# EasyEDA Pro project 快慢上电自动化.eprj

# Schematic Schematic1

## Sheets
1 P1
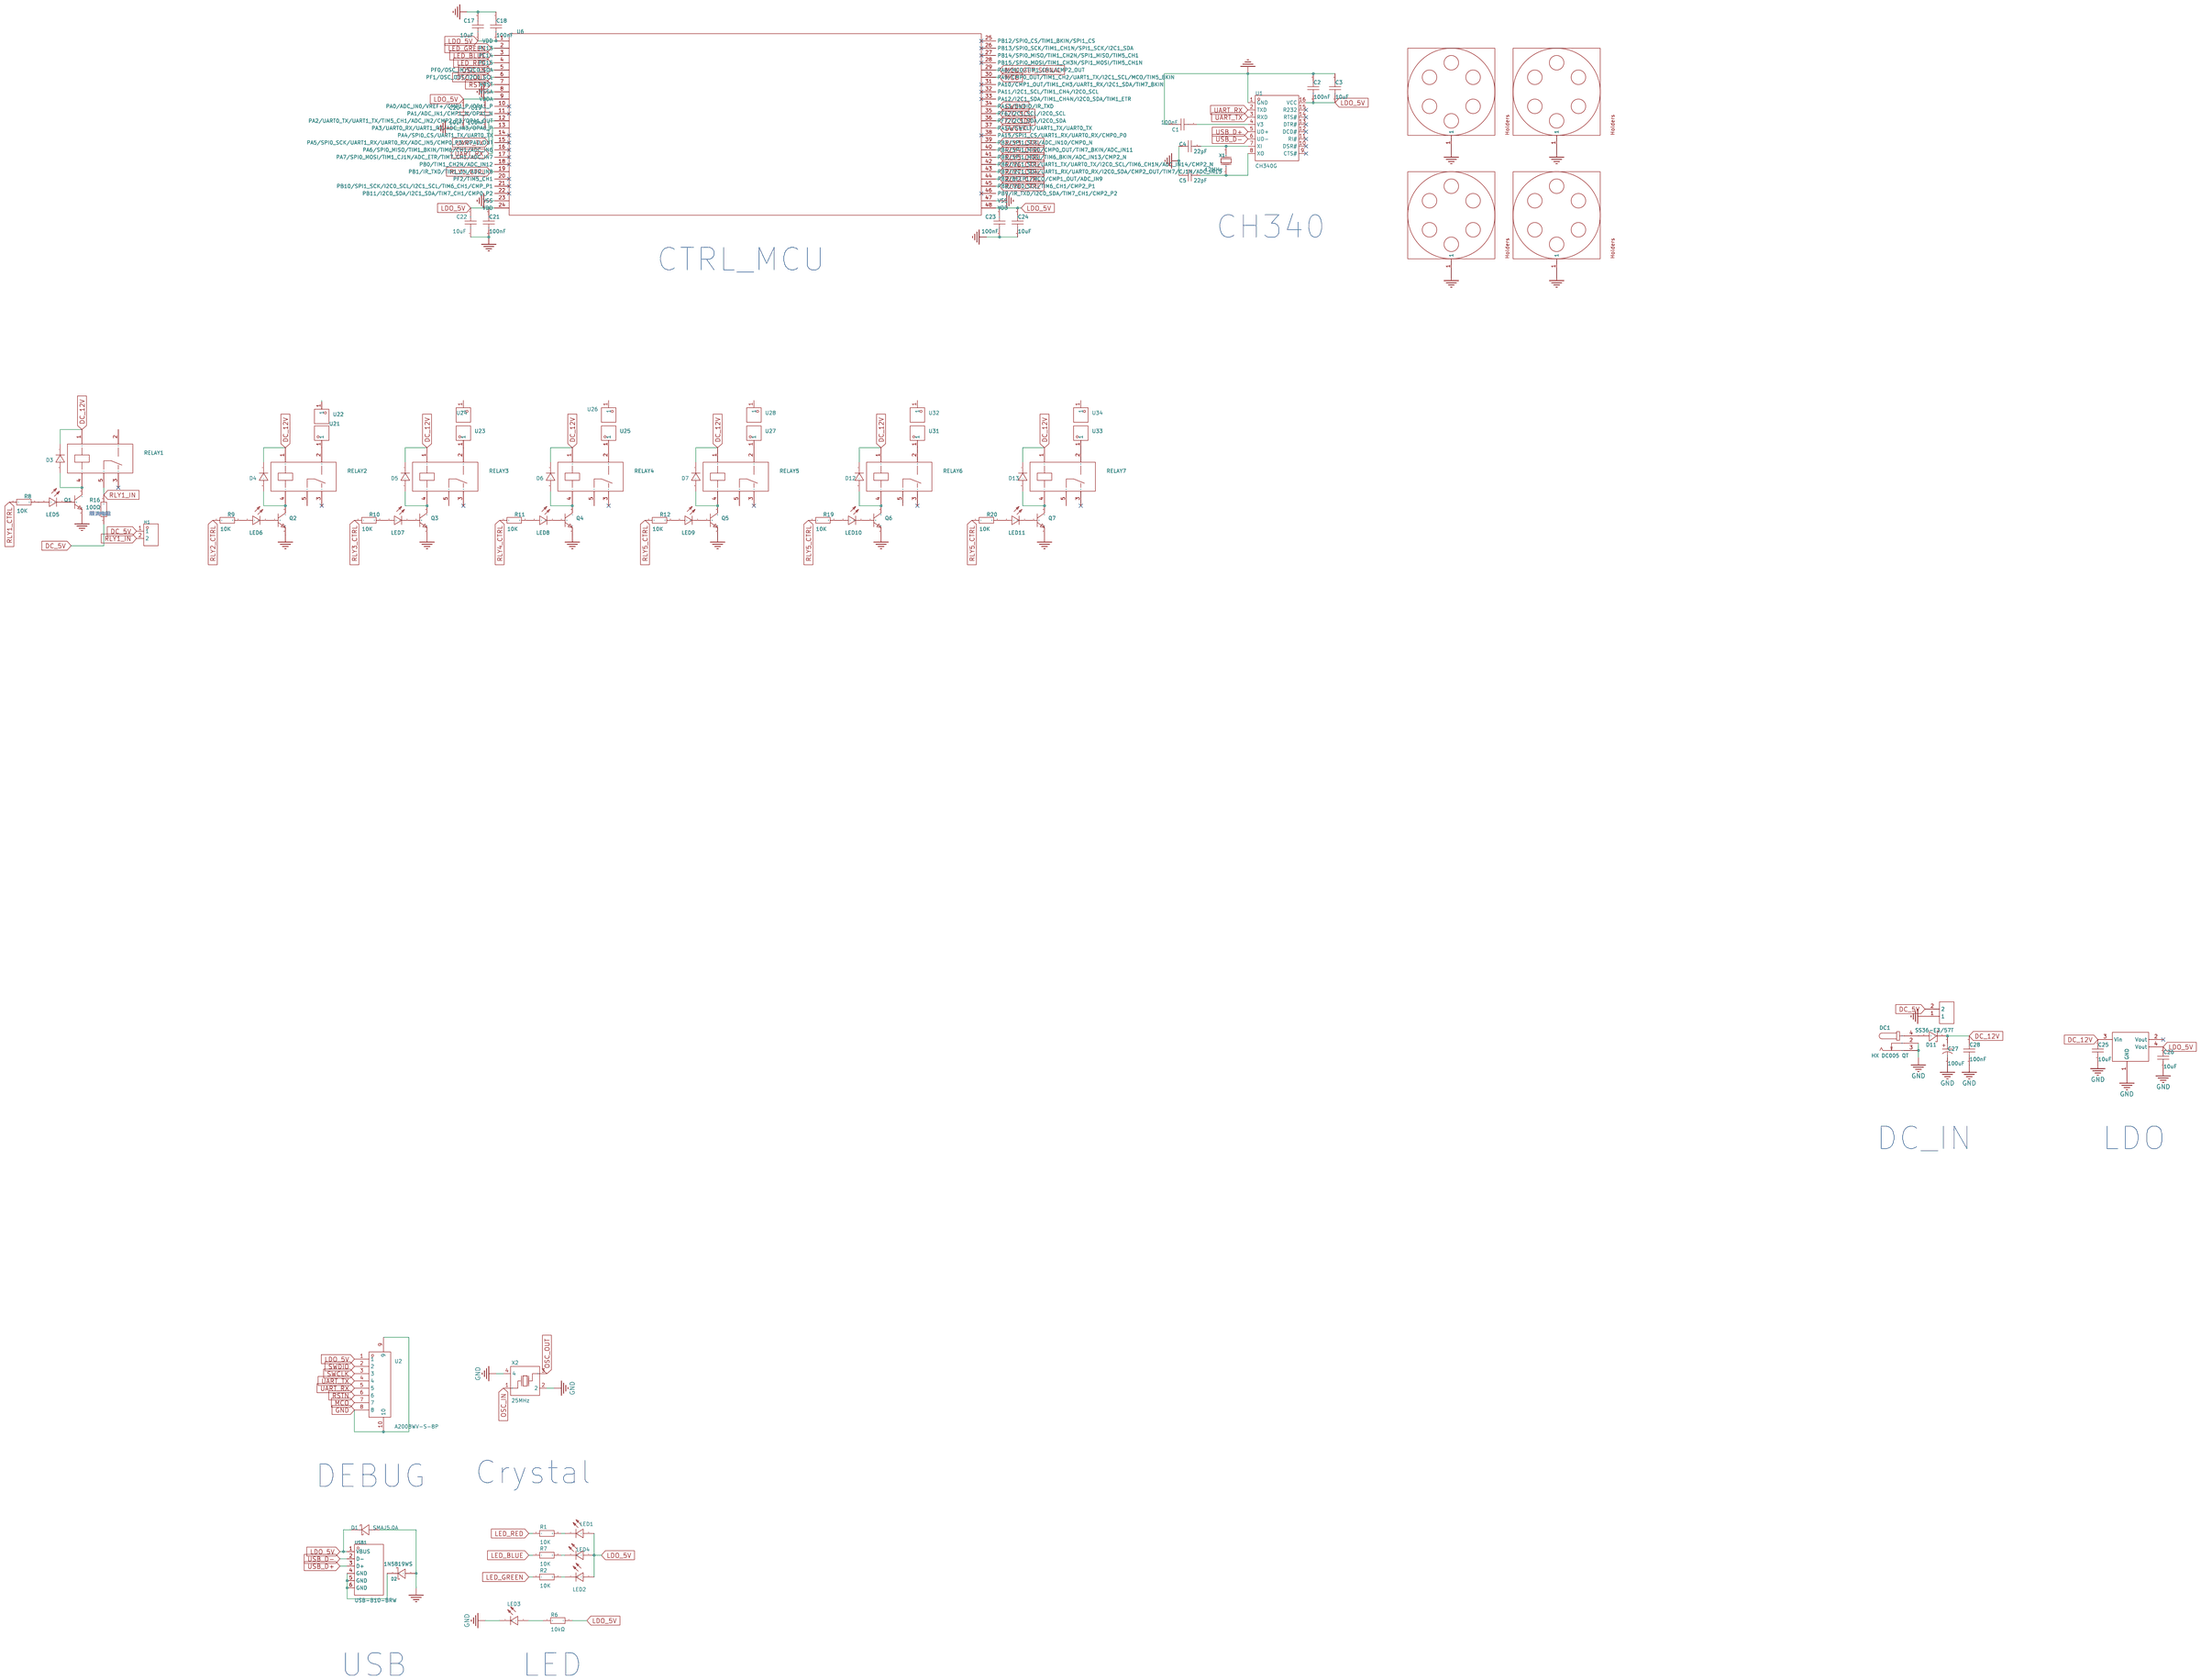
[diagram p0: P1]
2 P3: Create Date: 2023-10-24; Page Name: P3; Project Name: 快慢上电自动化; Schematic Name: Schematic1; Update Date: 2023-10-24; Company: 嘉立创EDA; Page Size: A4; Version: V1.0
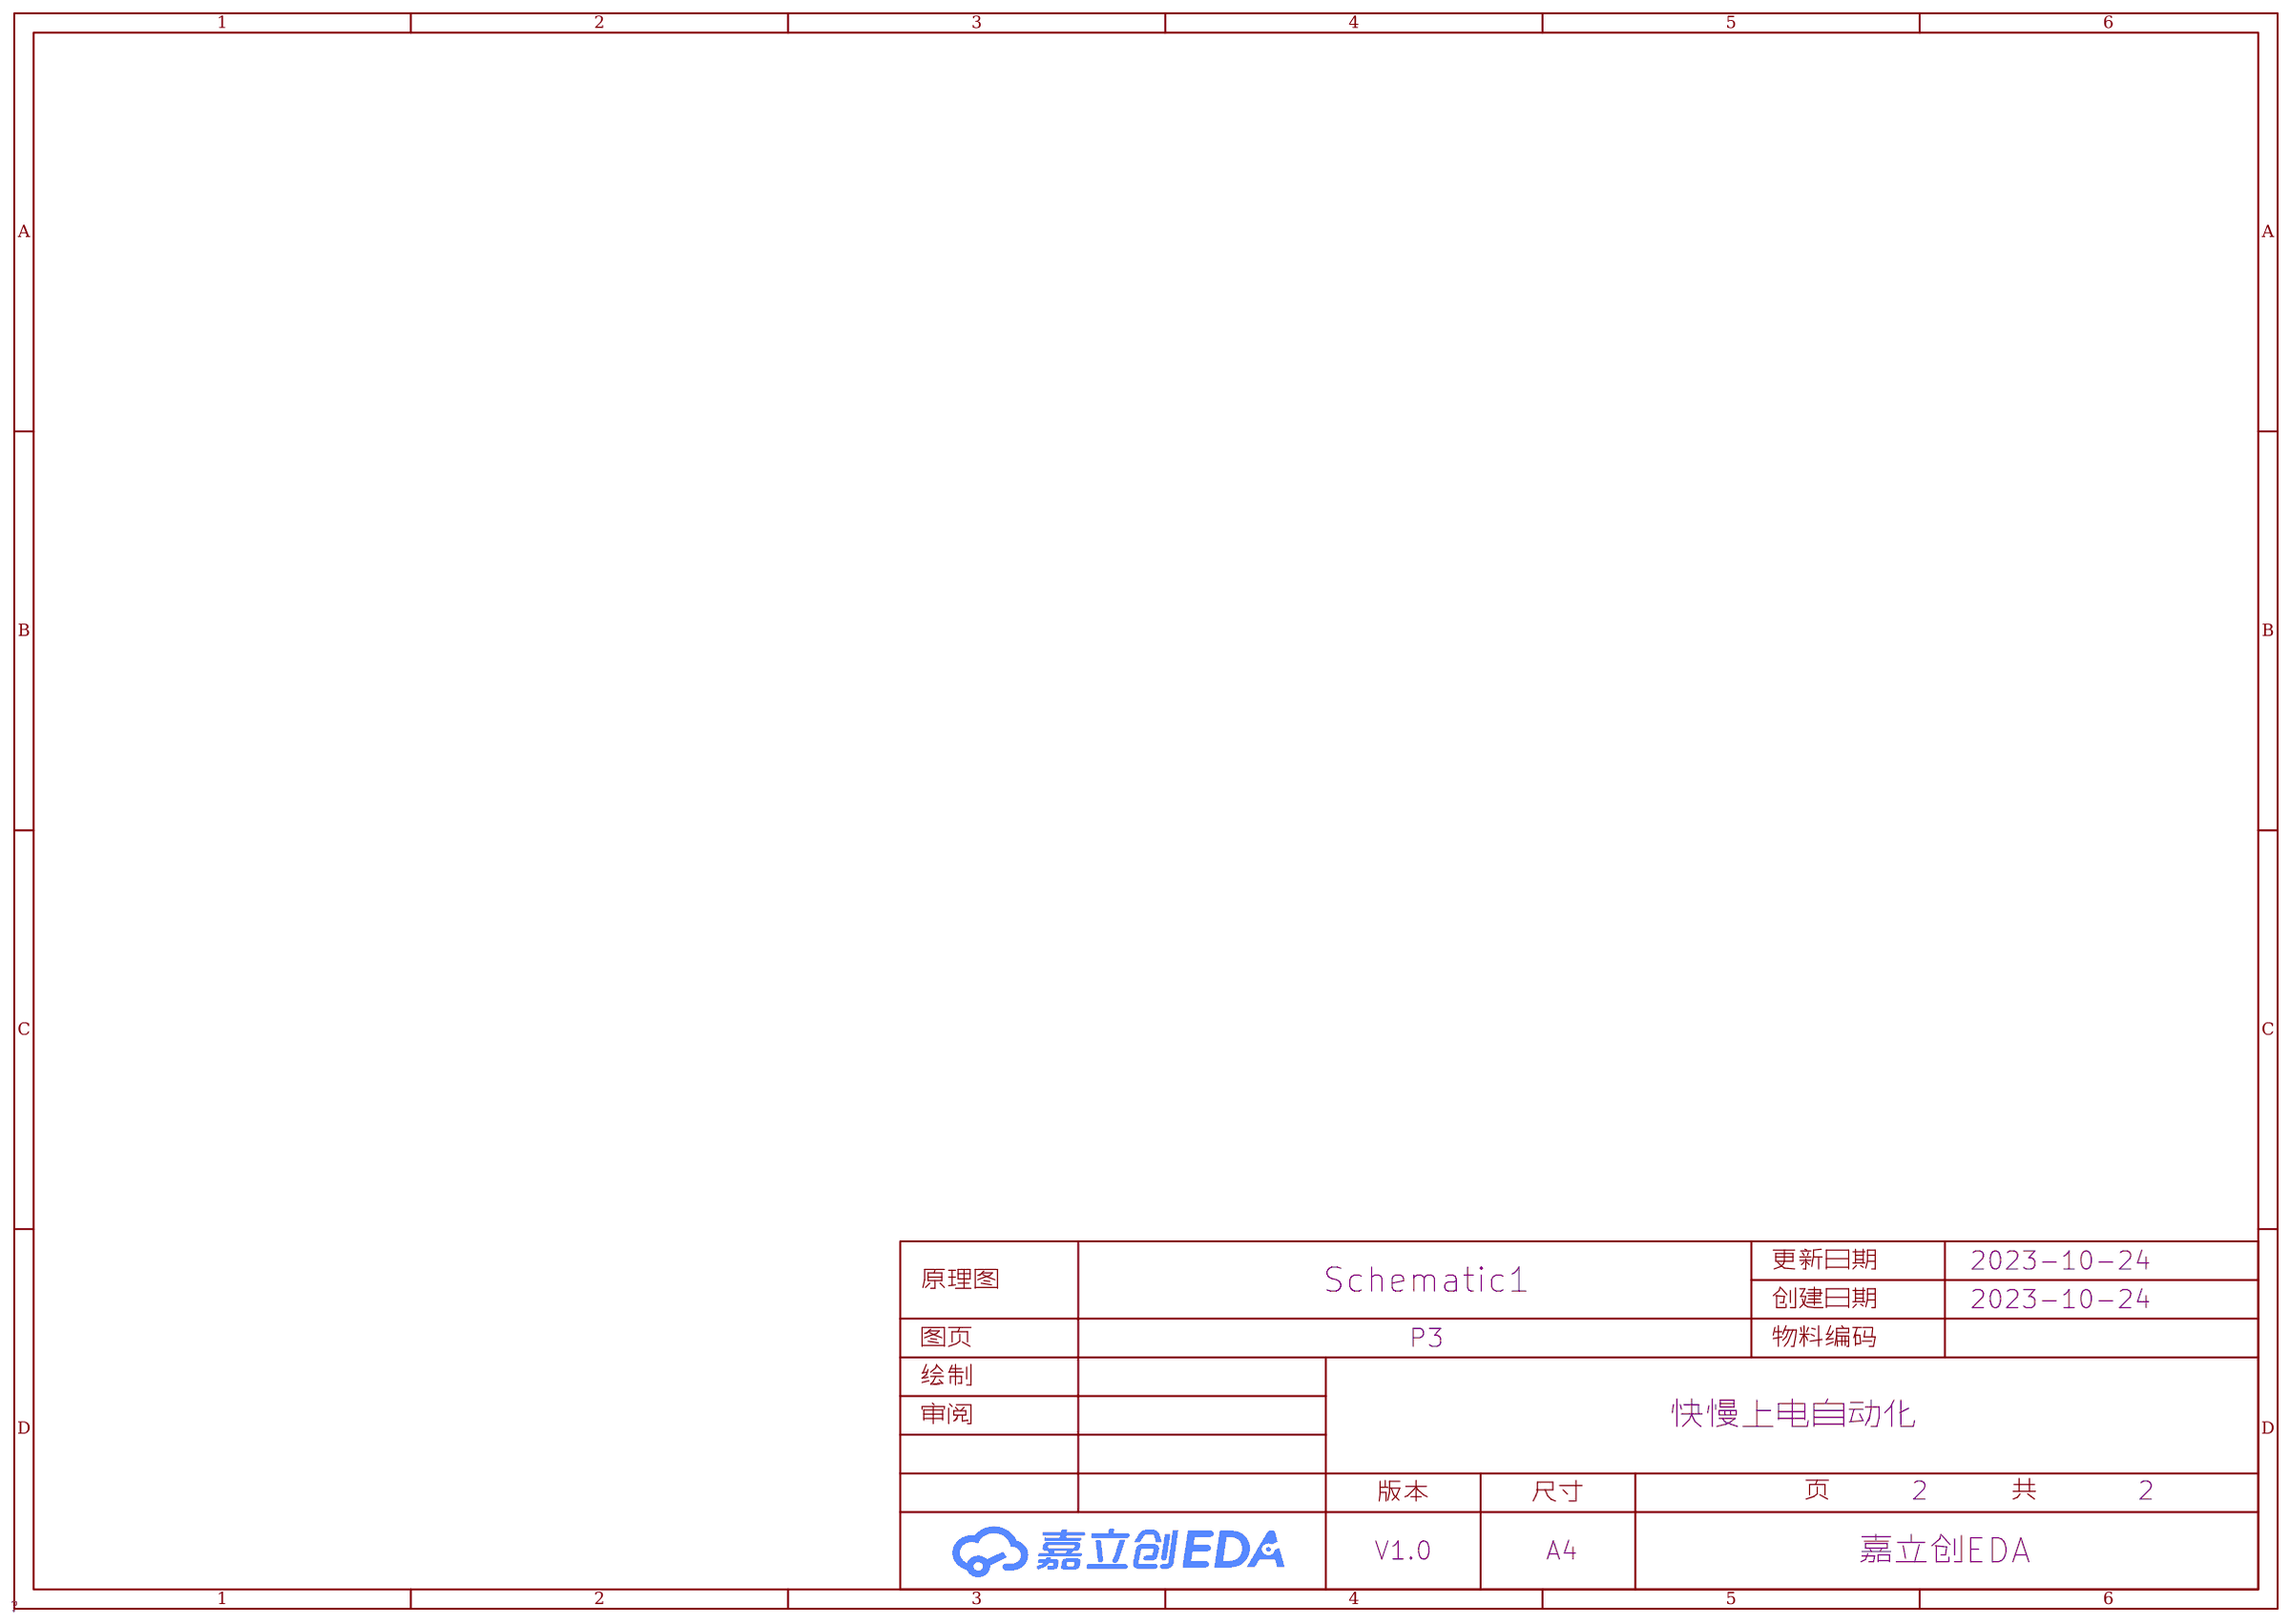
[diagram p1: P3]

## Parts
C1  100nF  [C0603]
C2  100nF  [C0603]
C3  10uF  [C0603]
C4  22pF  [C0603]
C5  22pF  [C0603]
C17  10uF  [C0603]
C18  100nF  [C0603]
C19  100nF  [C0603]
C20  10uF  [C0603]
C21  100nF  [C0603]
C22  10uF  [C0603]
C23  100nF  [C0603]
C24  10uF  [C0603]
C25  10uF  [C1206]
C26  10uF  [C1206]
C27  100uF  [CAP-SMD_BD6.3-L6.6-W6.6-LS7.6-FD-1]
C28  100nF  [C0603]
D1  SMAJ5.0A  [SMA_L4.3-W2.6-LS5.0-RD]
D2  1N5819WS  [SOD-323_L1.8-W1.3-LS2.5-RD]
D3  1N4148WS  [SOD-323_L1.8-W1.3-LS2.5-RD]
D4  1N4148WS  [SOD-323_L1.8-W1.3-LS2.5-RD]
D5  1N4148WS  [SOD-323_L1.8-W1.3-LS2.5-RD]
D6  1N4148WS  [SOD-323_L1.8-W1.3-LS2.5-RD]
D7  1N4148WS  [SOD-323_L1.8-W1.3-LS2.5-RD]
D11  SS36-E3/57T  [SMC_L7.1-W6.2-LS8.1-R-RD]
D12  1N4148WS  [SOD-323_L1.8-W1.3-LS2.5-RD]
D13  1N4148WS  [SOD-323_L1.8-W1.3-LS2.5-RD]
DC1  HX DC005 QT  [DC-IN-TH_HANXIA_HX-DC005-QT]
H1  PZ254V-11-02P  [HDR-TH_2P-P2.54-V-M]
J2  -  [DEMO板安装孔]
J3  -  [DEMO板安装孔]
J4  -  [DEMO板安装孔]
J5  -  [DEMO板安装孔]
LED1  NCD0603R1  [LED0603-RD_RED]
LED2  19-217/GHC-YR1S2/3T  [LED0603-RD]
LED3  19-217/GHC-YR1S2/3T  [LED0603-RD]
LED4  19-217/BHC-ZL1M2RY/3T  [LED0603-FD_BLUE]
LED5  19-217/GHC-YR1S2/3T  [LED0603-RD]
LED6  19-217/GHC-YR1S2/3T  [LED0603-RD]
LED7  19-217/GHC-YR1S2/3T  [LED0603-RD]
LED8  19-217/GHC-YR1S2/3T  [LED0603-RD]
LED9  19-217/GHC-YR1S2/3T  [LED0603-RD]
LED10  19-217/GHC-YR1S2/3T  [LED0603-RD]
LED11  19-217/GHC-YR1S2/3T  [LED0603-RD]
P1  WJ500V-5.08-2P  [CONN-TH_2P-P5.00_WJ500V-5.08-2P]
Q1  SS8050  [SOT-23-3_L2.9-W1.3-P1.90-LS2.4-BR]
Q2  SS8050  [SOT-23-3_L2.9-W1.3-P1.90-LS2.4-BR]
Q3  SS8050  [SOT-23-3_L2.9-W1.3-P1.90-LS2.4-BR]
Q4  SS8050  [SOT-23-3_L2.9-W1.3-P1.90-LS2.4-BR]
Q5  SS8050  [SOT-23-3_L2.9-W1.3-P1.90-LS2.4-BR]
Q6  SS8050  [SOT-23-3_L2.9-W1.3-P1.90-LS2.4-BR]
Q7  SS8050  [SOT-23-3_L2.9-W1.3-P1.90-LS2.4-BR]
R1  10K  [R0603]
R2  10K  [R0603]
R6  10kΩ  [R0603]
R7  10K  [R0603]
R8  10K  [R0603]
R9  10K  [R0603]
R10  10K  [R0603]
R11  10K  [R0603]
R12  10K  [R0603]
R16  100Ω  [R0805]
R19  10K  [R0603]
R20  10K  [R0603]
RELAY1  SRD-12VDC-SL-C  [RELAY-TH_SRD-XXVDC-XL-C]
RELAY2  SRD-12VDC-SL-C  [RELAY-TH_SRD-XXVDC-XL-C]
RELAY3  SRD-12VDC-SL-C  [RELAY-TH_SRD-XXVDC-XL-C]
RELAY4  SRD-12VDC-SL-C  [RELAY-TH_SRD-XXVDC-XL-C]
RELAY5  SRD-12VDC-SL-C  [RELAY-TH_SRD-XXVDC-XL-C]
RELAY6  SRD-12VDC-SL-C  [RELAY-TH_SRD-XXVDC-XL-C]
RELAY7  SRD-12VDC-SL-C  [RELAY-TH_SRD-XXVDC-XL-C]
U1  CH340G  [SOIC-16_L9.9-W3.9-P1.27-LS6.0-BL]
U2  A2008WV-S-8P  [CONN-SMD_A2008WV-S-8P]
U6  PT32A030C8T7  [LQFP-48_7.0X7.0X0.5P]
U21  X5511FV-01-C30D97-0970  [HDR-TH_1P-V-F-1]
U22  X5511FV-01-C30D97-0970  [HDR-TH_1P-V-F-1]
U23  X5511FV-01-C30D97-0970  [HDR-TH_1P-V-F-1]
U24  X5511FV-01-C30D97-0970  [HDR-TH_1P-V-F-1]
U25  X5511FV-01-C30D97-0970  [HDR-TH_1P-V-F-1]
U26  X5511FV-01-C30D97-0970  [HDR-TH_1P-V-F-1]
U27  X5511FV-01-C30D97-0970  [HDR-TH_1P-V-F-1]
U28  X5511FV-01-C30D97-0970  [HDR-TH_1P-V-F-1]
U30  AMS1086CM-5.0  [TO-263-3_L8.6-W10.2-P2.54-LS14.4-TL]
U31  X5511FV-01-C30D97-0970  [HDR-TH_1P-V-F-1]
U32  X5511FV-01-C30D97-0970  [HDR-TH_1P-V-F-1]
U33  X5511FV-01-C30D97-0970  [HDR-TH_1P-V-F-1]
U34  X5511FV-01-C30D97-0970  [HDR-TH_1P-V-F-1]
USB1  USB-B10-BRW  [USB-B-TH_USB-B10-BRW]
X1  12MHz  [HC-49US_L11.5-W4.5-P4.88]
X2  25MHz  [OSC-SMD_4P-L2.5-W2.0-BL]

## Library data of the parts
C1 C2 C18 C19 C21 C23 = CC0603KRX7R9BB104: 容值:100nF;精度:±10%;额定电压:50V;材质(温度系数):X7R;; LCSC Part Name: 100nF ±10% 50V; Supplier Part: C14663; Manufacturer: YAGEO(国巨); Supplier Footprint: 0603; JLCPCB Part Class: Basic Part; Datasheet: https://atta.szlcsc.com/upload/public/pdf/source/20180910/C282072_33301C7F631E79921B82A8DAC6BCC5B3.pdf; Supplier: LCSC; Tolerance: ±10%; Voltage Rated: 50V; Temperature Coefficient: X7R
C3 C17 C20 C22 C24 = CL10A106KP8NNNC: 容值:10uF;精度:±10%;额定电压:10V;材质(温度系数):X5R;; LCSC Part Name: 10uF ±10% 10V; Supplier Part: C19702; Manufacturer: SAMSUNG(三星); Supplier Footprint: 0603; JLCPCB Part Class: Basic Part; Datasheet: https://atta.szlcsc.com/upload/public/pdf/source/20160103/1457707703378.pdf; Supplier: LCSC; Tolerance: ±10%; Voltage Rated: 10V; Temperature Coefficient: X5R
C4 C5 = CL10C220JB8NNNC: 容值:22pF;精度:±5%;额定电压:50V;材质(温度系数):C0G;; LCSC Part Name: 22pF ±5% 50V; Supplier Part: C1653; Manufacturer: SAMSUNG(三星); Supplier Footprint: 0603; JLCPCB Part Class: Basic Part; Datasheet: https://atta.szlcsc.com/upload/public/pdf/source/20160103/1457707687317.pdf; Supplier: LCSC; Tolerance: ±5%; Voltage Rated: 50V; Temperature Coefficient: C0G
C25 C26 = CL31A106KBHNNNE: 容值:10uF;精度:±10%;额定电压:50V;材质(温度系数):X5R;; LCSC Part Name: 10uF ±10% 50V; Supplier Part: C13585; Manufacturer: SAMSUNG(三星); Supplier Footprint: 1206; JLCPCB Part Class: Basic Part; Datasheet: https://atta.szlcsc.com/upload/public/pdf/source/20160103/1457707668742.pdf; Supplier: LCSC; Tolerance: ±10%; Voltage Rated: 50V; Temperature Coefficient: X5R
C27 = RVE100UF35V67RV0072: 容值:100uF;额定电压:35V;电容体直径:-;电容体长度:-;纹波电流:-;等效串联电阻:-;工作寿命:-;; LCSC Part Name: 100uF 35V; Supplier Part: C2836437; Manufacturer: KNSCHA(科尼盛); Supplier Footprint: SMD,6.3x7.7mm; JLCPCB Part Class: Extended Part; Datasheet: https://atta.szlcsc.com/upload/public/pdf/source/20220719/B52EB46F8A1558448ED03D8B4CB3C24F.pdf; Supplier: LCSC; Rated Voltage: 35V
C28 = CL10B104KB8NNNC: 容值:100nF;精度:±10%;额定电压:50V;材质(温度系数):X7R;; LCSC Part Name: 100nF ±10% 50V; Supplier Part: C1591; Manufacturer: SAMSUNG(三星); Supplier Footprint: 0603; JLCPCB Part Class: Extended Part; Datasheet: https://atta.szlcsc.com/upload/public/pdf/source/20160103/1457707680512.pdf; Supplier: LCSC; Tolerance: ±10%; Voltage Rated: 50V; Temperature Coefficient: X7R
D1 = SMAJ5.0A_C2925443: 极性:单向;反向截止电压(Vrwm):5V;击穿电压:6.4V;最大钳位电压:9.2V;; LCSC Part Name: 单向 Vrwm:5V 400W; Supplier Part: C2925443; Manufacturer: Liown(里阳半导体); Supplier Footprint: SMA(DO-214AC); JLCPCB Part Class: Basic Part; Datasheet: https://atta.szlcsc.com/upload/public/pdf/source/20220105/F191C4E1C1B4B3234C818651946730B4.pdf; Supplier: LCSC; Polarity: 单向; Reverse Stand-Off Voltage (Vrwm): 5V; Breakdown Voltage: 6.4V; Reverse Leakage Current (Ir): 800uA; Peak Pulse Current (Ipp)@10/1000μs: 43.5A; Maximum Clamping Voltage: 9.2V; Peak Pulse Power Dissipation (Ppp)@10/1000μs: 400W
D2 = 1N5819WS_C191023: 直流反向耐压(Vr):40V;平均整流电流(Io):1A;正向压降(Vf):600mV@1A;; LCSC Part Name: 40V 1A 600mV@1A; Supplier Part: C191023; Manufacturer: Hottech(合科泰); Supplier Footprint: SOD-323; JLCPCB Part Class: Basic Part; Datasheet: https://atta.szlcsc.com/upload/public/pdf/source/20220428/3CB86FD8D28D653594B4E35F9D5AEFD9.pdf; Supplier: LCSC; Reverse Voltage (Vr): 40V; Average Rectified Current (Io): 1A; Forward Voltage (Vf@If): 600mV@1A
D3-D7 D12 D13 = 1N4148WS_C2128: 二极管配置:独立式;功率:200mW;直流反向耐压(Vr):100V;平均整流电流(Io):150mA;正向压降(Vf):1.25V@150mA;反向恢复时间(trr):4ns;; LCSC Part Name: 电压:100V 电流:150mA T4; Supplier Part: C2128; Manufacturer: CJ(江苏长电/长晶); Supplier Footprint: SOD-323; JLCPCB Part Class: Basic Part; Datasheet: https://atta.szlcsc.com/upload/public/pdf/source/20140809/1457707208178.pdf; Supplier: LCSC; Diode Configuration: 独立式; Power Dissipation: 200mW; Reverse Voltage (Vr): 100V; Average Rectified Current (Io): 150mA; Forward Voltage (Vf@If): 1.25V@150mA; Reverse Leakage Current: 1uA@75V; Reverse Recovery Time (trr): 4ns; Operating Temperature: +150℃@(Tj)
D11 = SS36-E3/57T: 直流反向耐压（Vr）:60V;平均整流电流（Io）:3A;正向压降（Vf）:750mV @ 3A;; Supplier Part: C35722; Manufacturer: VISHAY(威世); Supplier Footprint: SMC(DO-214AB); JLCPCB Part Class: Basic Part; Datasheet: https://atta.szlcsc.com/upload/public/pdf/source/20151007/1457707426323.pdf; Supplier: LCSC
DC1 = HX DC005 QT: 连接器类型:DC插座;安装方式:卧插;额定电流:1A;额定电压:12V;工作温度范围:-25℃~+85℃;; LCSC Part Name: DC插座; Supplier Part: C5184829; Manufacturer: hanxia(韩下); Supplier Footprint: 插件; JLCPCB Part Class: Extended Part; Datasheet: https://atta.szlcsc.com/upload/public/pdf/source/20220930/72F2DABD42189BF434FA6ABB0C092A1C.pdf; Supplier: LCSC; Connector Type: DC插座; Mounting Style: 卧插; Current Rating (Max): 1A; Voltage Rating (Max): 12V; Operating Temperature Range: -25℃~+85℃
H1 = PZ254V-11-02P: 排数:单排;总PIN位数:2;间距:2.54mm;插针结构:1x2P;行距:-;安装类型:直插;圆针/方针:方针;额定电流:-;额定电压:-;配合针长度:6mm;塑高:2.5mm;端接针长度:3mm;触头材质:黄铜;触头镀层:-;工作温度范围:-40℃~+105℃;颜色:黑色;; LCSC Part Name: 2.54mm 1x2P 直插 方针; Supplier Part: C492401; Manufacturer: XFCN(兴飞); Supplier Footprint: 直插,P=2.54mm; JLCPCB Part Class: Extended Part; Datasheet: https://atta.szlcsc.com/upload/public/pdf/source/20200309/C492401_A812433581A9B211A7FFA413ADDFF0E5.pdf; Supplier: LCSC; Number of Rows: 单排; Number of Pins: 2; Pitch: 2.54mm; Pin Structure: 1x2P; Mounting Type: 直插; Circluar Pins/Square Pins: 方针; Length of Mating Pin: 6mm; Insulation Height: 2.5mm; Length of End Connection Pin: 3mm; Contact Material: 黄铜; Operating Temperature Range: -40℃~+105℃; Color: 黑色
J2-J5 = 螺孔_3.1X6MM
LED1 = NCD0603R1_C84263: 发光颜色:红灯;; LCSC Part Name: 红灯; Supplier Part: C84263; Manufacturer: 国星光电; Supplier Footprint: 0603; JLCPCB Part Class: Extended Part; Datasheet: https://atta.szlcsc.com/upload/public/pdf/source/20200820/C84263_DABC6A75E58F576973B407FDBA283D60.pdf; Supplier: LCSC; Emitted Color: 红灯
LED2 LED3 LED5-LED11 = 19-217/GHC-YR1S2/3T: 发光颜色:翠绿;二极管配置:-;透镜颜色:无色透明;主波长:520nm~535nm;峰值波长:518nm;色温:-;测试电流:20mA;功率:110mW;发光角度:120°;安装方式:-;工作温度:-40℃~+85℃;; LCSC Part Name: 翠绿 520nm~535nm; Supplier Part: C72043; Manufacturer: EVERLIGHT(亿光); Supplier Footprint: 0603; JLCPCB Part Class: Basic Part; Datasheet: https://atta.szlcsc.com/upload/public/pdf/source/20160507/1462613613780.pdf; Supplier: LCSC; Emitted Color: 翠绿; Lens Color: 无色透明; Dominant Wavelength: 520nm~535nm; Peak Wavelength: 518nm; Forward Current: 20mA; Power Dissipation: 110mW; Viewing Angle: 120°; Operating Temperature: -40℃~+85℃
LED4 = 19-217/BHC-ZL1M2RY/3T: 发光颜色:蓝灯;二极管配置:-;主波长:465nm~475nm;色温:-;功率:110mW;安装方式:-;; LCSC Part Name: 蓝灯; Supplier Part: C72041; Manufacturer: EVERLIGHT(亿光); Supplier Footprint: 0603; JLCPCB Part Class: Basic Part; Datasheet: https://atta.szlcsc.com/upload/public/pdf/source/20170116/1484561237273.pdf; Supplier: LCSC; Emitted Color: 蓝灯; Lens Color: 无色透明; Dominant Wavelength: 465nm~475nm; Peak Wavelength: 468nm; Forward Current: 5mA; Power Dissipation: 110mW; Viewing Angle: 120°; Operating Temperature: -40℃~+85℃
P1 = WJ500V-5.08-2P: 间距:5.08mm;结构:1x2P;排数:1;每排PIN数:2;安装方式:直针;额定电流:18A;额定电压:250V;线规 - AWG:14~30;线规 - mm2:2.5;工作温度范围:-40℃~+105℃;颜色:绿色;; LCSC Part Name: 5.08mm 1x2P 排数:1 每排P数:2 直针 可拼接; Supplier Part: C8465; Manufacturer: KANGNEX(康奈克斯电气); Supplier Footprint: 插件,P=5.08mm; JLCPCB Part Class: Extended Part; Datasheet: https://atta.szlcsc.com/upload/public/pdf/source/20191225/C8465_02D34CE5B5B4A53DF5891601D97FA9F4.pdf; Supplier: LCSC; Pitch: 5.08mm; Structure: 1x2P; Number of Rows: 1; Number of PINs Per Row: 2; Mounting Style: 直针; Current Rating (Max): 18A; Voltage Rating (Max): 250V; Wire Gauge - AWG: 14~30; Wire Gauge - mm2: 2.5; Operating Temperature Range: -40℃~+105℃; Color: 绿色
Q1-Q7 = SS8050_C2150: 晶体管类型:NPN;集射极击穿电压(Vceo):25V;集电极电流(Ic):1.5A;功率(Pd):300mW;直流电流增益(hFE@Ic,Vce):200@100mA,1V;; LCSC Part Name: NPN 25V 1.5A Y1 200-350; Supplier Part: C2150; Manufacturer: CJ(江苏长电/长晶); Supplier Footprint: SOT-23; JLCPCB Part Class: Basic Part; Datasheet: https://atta.szlcsc.com/upload/public/pdf/source/20230322/AEE86F4B043774EFF80CAEA14A37D9E9.pdf; Supplier: LCSC; Transistor Type: NPN; Collector-Emitter Breakdown Voltage (Vceo): 25V; Collector Current (Ic): 1.5A; Power Dissipation (Pd): 300mW; Collector Cut-Off Current (Icbo): 100nA; Collector-Emitter Saturation Voltage (VCE(sat)@Ic,Ib): 500mV@800mA,80mA; DC Current Gain (hFE@Ic,Vce): 200@100mA,1V; Transition Frequency (fT): 100MHz; Operating Temperature: +150℃@(Tj)
R1 R2 R7-R12 R19 R20 = Res_0603: Supplier Footprint: 0603
R6 = 0603WAF1002T5E: 电阻类型:厚膜电阻;阻值:10kΩ;精度:±1%;功率:100mW;温度系数:±100ppm/℃;最大工作电压:75V;工作温度范围:-55℃~+155℃;; LCSC Part Name: 10kΩ ±1% 100mW; Supplier Part: C25804; Manufacturer: UNI-ROYAL(厚声); Supplier Footprint: 0603; JLCPCB Part Class: Basic Part; Datasheet: https://atta.szlcsc.com/upload/public/pdf/source/20200306/C422600_1E6D84923E4A46A82E41ADD87F860B5C.pdf; Supplier: LCSC; Type: 厚膜电阻; Tolerance: ±1%; Power(Watts): 100mW; Temperature Coefficient: ±100ppm/℃; Overload Voltage (Max): 75V; Operating Temperature Range: -55℃~+155℃
R16 = 0805W8F1000T5E: 电阻类型:厚膜电阻;阻值:100Ω;精度:±1%;功率:125mW;; LCSC Part Name: 100Ω ±1% 125mW; Supplier Part: C17408; Manufacturer: UNI-ROYAL(厚声); Supplier Footprint: 0805; JLCPCB Part Class: Basic Part; Datasheet: https://atta.szlcsc.com/upload/public/pdf/source/20200306/C422600_1E6D84923E4A46A82E41ADD87F860B5C.pdf; Supplier: LCSC; Type: 厚膜电阻; Tolerance: ±1%; Power(Watts): 125mW; Temperature Coefficient: ±100ppm/℃; Overload Voltage (Max): 150V; Operating Temperature Range: -55℃~+155℃
RELAY1-RELAY7 = SRD-12VDC-SL-C: 线圈电压:12V;引脚数:5;触点形式:一组转换:1C(单刀双掷-转换);触点容量(电阻负载):-;; LCSC Part Name: 12V继电器 单刀双掷 蓝色; Supplier Part: C30431; Manufacturer: 松乐; Supplier Footprint: 插件,15.6x19.2mm; JLCPCB Part Class: Extended Part; Datasheet: https://atta.szlcsc.com/upload/public/pdf/source/20180525/C30431_534ADD4B54993D382CD0EDFAB06D3E7F.pdf; Supplier: LCSC; Coil Voltage: 12V; Coil Type: 非极化-单线圈; Pin Number: 5; Contact Form: 一组转换:1C(单刀双掷-转换); Maximum Switching Current: 15A; Maximum Switching Voltage: 250V@AC; Coil Rated Power: 360mW; Coil Resistance: 400Ω; Operate Time: 10ms; Release Time: 10ms; Contact Resistance: 100mΩ
U1 = CH340G: 应用功能:Transceiver;接口协议:USB 2.0;数据速率:2Mbps;供电电压:3.3V；5V;; Supplier Part: C14267; Manufacturer: WCH(南京沁恒); Supplier Footprint: SOP-16; JLCPCB Part Class: Extended Part; Datasheet: https://atta.szlcsc.com/upload/public/pdf/source/20200819/C14267_9F0B4B8160AEBA86F3219E64956E4601.pdf; Supplier: LCSC; Applications Function: Transceiver; Protocol: USB 2.0; Data Rate: 2Mbps; Supply Voltage: 3.3V；5V
U2 = A2008WV-S-8P: 参考系列:PH;间距:2mm;插针结构:1x8P;排数:1;每排PIN数:8;行距:-;安装方式:-;触头材质:黄铜;; LCSC Part Name: PH 2mm 1x8P 镀锡; Supplier Part: C273128; Manufacturer: CJT(长江连接器); Supplier Footprint: SMD,P=2mm; JLCPCB Part Class: Extended Part; Datasheet: https://atta.szlcsc.com/upload/public/pdf/source/20180913/C273128_BB1852F7672CD820F7AD4E26555E7BEC.pdf; Supplier: LCSC; Reference Series: PH; Pitch: 2mm; Pins Structure: 1x8P; Number of Rows: 1; Number of PINs Per Row: 8; Contact Material: 黄铜
U6 = PT32A030C8T7
U21-U28 U31-U34 = X5511FV-01-C30D97-0970: 排数:单排;总孔位数:1P;间距:2.54mm;插孔结构:1x1P;行距:-;安装类型:直插;圆孔/方孔:圆孔;额定电流:-;额定电压:-;插孔方向:顶部;塑高:3mm;触头材质:黄铜;触头镀层:金;工作温度范围:-40℃~+105℃;焊接温度(最大值):260℃;; LCSC Part Name: 间距:2.54mm 1x1P 直插; Supplier Part: C2883469; Manufacturer: XKB Connectivity(中国星坤); Supplier Footprint: 插件,P=2.54mm; JLCPCB Part Class: Extended Part; Datasheet: https://atta.szlcsc.com/upload/public/pdf/source/20211009/43EC1C49F931A7FEC57CD081BD1C4E7E.pdf; Supplier: LCSC; Number of Rows: 单排; Number of Holes: 1P; Pitch: 2.54mm; Holes Structure: 1x1P; Mounting Type: 直插; Circular Hole / Square Hole: 圆孔; Holes Direction: 顶部; Insulation Height: 3mm; Contact Material: 黄铜; Contact Plating: 金; Operating Temperature Range: -40℃~+105℃; Welding Temperature (Max): 260℃
U30 = AMS1086CM-5.0: 输出类型:固定;输出极性:正;最大输入电压:15V;输出电压:5V;输出电流:1.5A;电源纹波抑制比(PSRR):68dB@(120Hz);; LCSC Part Name: 输入15V 输出5V 1.5A; Supplier Part: C27631; Manufacturer: AMS; Supplier Footprint: TO-263-3; JLCPCB Part Class: Extended Part; Datasheet: https://atta.szlcsc.com/upload/public/pdf/source/20140314/1457707017583.pdf; Supplier: LCSC; Output Type: 固定; Output Polarity: 正; Number of Outputs: 1; Maximum Input Voltage: 15V; Output Voltage: 5V; Dropout Voltage: 1.5V@(1.5A); Output Current: 1.5A; Power Supply Rejection Ratio (PSRR): 68dB@(120Hz)
USB1 = USB-B10-BRW: 连接器类型:Type-B;标准:USB 2.0;公母:母座;触点数量:4P;端口数量:1;安装方式:弯插;额定电流 - 电源:1.5A;工作温度范围:-20℃~+70℃;焊接温度(最大值):260℃;; LCSC Part Name: Type-B 母座 弯插; Supplier Part: C720549; Manufacturer: XUNPU(讯普); Supplier Footprint: 插件; JLCPCB Part Class: Extended Part; Datasheet: https://atta.szlcsc.com/upload/public/pdf/source/20200812/C720549_53E9294752E2933874870440E626C579.pdf; Supplier: LCSC; Connector Type: Type-B; Standard: USB 2.0; Gender: 母座; Number of Contacts: 4P; Number of Ports: 1; Mounting Style: 弯插; Current Rating - Power (Max): 1.5A; Operating Temperature Range: -20℃~+70℃; Welding Temperature (Max): 260℃
X1 = X49SD12MSD2SC: 频率:12MHz;频率公差:±20ppm;负载电容:20pF;; LCSC Part Name: 12MHz ±20ppm 20pF HC-49US; Supplier Part: C16369; Manufacturer: YXC(扬兴晶振); Supplier Footprint: HC-49S; JLCPCB Part Class: Extended Part; Datasheet: https://atta.szlcsc.com/upload/public/pdf/source/20210903/A997D130AE99CBB55D9024F9BE6DA174.pdf; Supplier: LCSC; Crystal Type: 49S晶振; Frequency Tolerance: ±20ppm; Frequency Stability: ±30ppm; Load Capacitance: 20pF; Operating Temperature: -20℃~+70℃
X2 = ECS-250-10-36Q-AES-TR: 晶振类型:-;频率:25MHz;频率公差:±25ppm;频率稳定度:±50ppm;负载电容:10pF;等效串联电阻(ESR):60Ω;工作温度:-40℃~+125℃;; LCSC Part Name: 25MHz ±25ppm 10pF; Supplier Part: C435199; Manufacturer: ECS; Supplier Footprint: SMD2520-4P; JLCPCB Part Class: Extended Part; Datasheet: https://atta.szlcsc.com/upload/public/pdf/source/20200102/C435199_2BF86DF6FEC67718933C4FC174F98801.pdf; Supplier: LCSC; Frequency Tolerance: ±25ppm; Frequency Stability: ±50ppm; Load Capacitance: 10pF; Equivalent Series Resistance (ESR): 60Ω; Operating Temperature: -40℃~+125℃

## Nets
GND: C1.2 C2.1 C3.2 C4.1 C5.1 C17.2 C18.1 C19.2 C20.1 C21.2 C22.1 C23.2 C24.1 C25.2 C26.1 C27.2 C28.1 D1.2(A) D2.2(A) DC1.2 DC1.3 J2.1 J3.1 J4.1 J5.1 LED3.1(C) P1.1 Q1.2(E) Q2.2(E) Q3.2(E) Q4.2(E) Q5.2(E) Q6.2(E) Q7.2(E) U1.1(GND) U2.8 U2.9 U2.10 U6.8(VSSA) U6.23(VSS) U6.47(VSS) U30.1(GND) X2.2 X2.4
DC_5V: H1.1 P1.2 R16.1
DC_12V: C25.1 C27.1 C28.2 D3.1(K) D4.1(K) D5.1(K) D6.1(K) D7.1(K) D11.2(K) D12.1(K) D13.1(K) RELAY1.1 RELAY2.1 RELAY3.1 RELAY4.1 RELAY5.1 RELAY6.1 RELAY7.1 U30.3(Vin)
I2C_SCL: U6.35(PF6/I2C1_SCL/I2C0_SCL)
I2C_SDA: U6.36(PF7/I2C1_SDA/I2C0_SDA)
LDO_5V: C2.2 C3.1 C17.1 C18.2 C19.1 C20.2 C21.1 C22.2 C23.1 C24.2 C26.2 D1.1(K) LED1.2(A) LED2.2(A) LED4.2(A) R6.2 U1.16(VCC) U2.1 U6.1(VDD) U6.9(VDDA) U6.24(VDD) U6.48(VDD) U30.4(Vout) USB1.1(VBUS)
LED_BLUE: R7.1 U6.3(PC14)
LED_GREEN: R2.1 U6.2(PC13)
LED_RED: R1.1 U6.4(PC15)
MCO: U2.7 U6.30(PA9/CMP0_OUT/TIM1_CH2/UART1_TX/I2C1_SCL/MCO/TIM5_BKIN)
MCU_GET_SIGNAL: U6.29(PA8/MCO/TIM1_CH1/CMP2_OUT)
OSC_IN: U6.5(PF0/OSC_IN/I2C0_SDA) X2.1(OSC1)
OSC_OUT: U6.6(PF1/OSC_OUT/I2C0_SCL) X2.3(OSC2)
RLY1_CTRL: R8.1 U6.19(PB1/IR_TXD/TIM1_3N/ADC_IN8)
RLY1_IN: H1.2 R16.2 RELAY1.5
RLY2_CTRL: R9.1 U6.44(PB2/BEEP1/MCO/CMP1_OUT/ADC_IN9)
RLY3_CTRL: R10.1 U6.39(PB3/SPI1_SCK/ADC_IN10/CMP0_N)
RLY4_CTRL: R11.1 U6.40(PB4/SPI1_MISO/CMP0_OUT/TIM7_BKIN/ADC_IN11)
RLY5_CTRL: R12.1 R19.1 R20.1 U6.41(PB5/SPI1_MOSI/TIM6_BKIN/ADC_IN13/CMP2_N)
RLY6_CTRL: U6.42(PB6/I2C1_SCL/UART1_TX/UART0_TX/I2C0_SCL/TIM6_CH1N/ADC_IN14/CMP2_N)
RLY7_CTRL: U6.43(PB7/I2C1_SDA/UART1_RX/UART0_RX/I2C0_SDA/CMP2_OUT/TIM7/CJ1N/ADC_IN15)
RLY8_CTRL: U6.45(PB8/I2C0_SCL/TIM6_CH1/CMP2_P1)
RSTN: U2.6 U6.7(NRST)
SWCLK: U2.3 U6.37(PA14/SWCLK/UART1_TX/UART0_TX)
SWDIO: U2.2 U6.34(PA13/SWDIO/IR_TXD)
UART_RX: U1.2(TXD) U2.5 U6.13(PA3/UART0_RX/UART1_RX/ADC_IN3/OPA0_P)
UART_TX: U1.3(RXD) U2.4 U6.12(PA2/UART0_TX/UART1_TX/TIM5_CH1/ADC_IN2/CMP2_P3/OPA1_OUT)
USB_D+: U1.5(UD+) USB1.3(D+)
USB_D-: U1.6(UD-) USB1.2(D-)
$1N609: C1.1 U1.4(V3)
$1N927: C4.2 U1.7(XI) X1.1(OSC1)
$1N934: C5.2 U1.8(XO) X1.2(OSC2)
$1N1592: D2.1(K) USB1.4(GND) USB1.5(GND) USB1.6(GND)
$1N3043: LED2.1(C) R2.2
$1N3044: LED1.1(K) R1.2
$1N19109: LED3.2(A) R6.1
$1N19270: LED4.1(C) R7.2
$1N21850: D3.2(A) Q1.3(C) RELAY1.4
$1N23236: LED5.1(C) Q1.1(B)
$1N23238: LED5.2(A) R8.2
$1N23497: D4.2(A) Q2.3(C) RELAY2.4
$1N23502: LED6.1(C) Q2.1(B)
$1N23504: LED6.2(A) R9.2
$1N24457: D5.2(A) Q3.3(C) RELAY3.4
$1N24462: LED7.1(C) Q3.1(B)
$1N24464: LED7.2(A) R10.2
$1N24850: D6.2(A) Q4.3(C) RELAY4.4
$1N24855: LED8.1(C) Q4.1(B)
$1N24857: LED8.2(A) R11.2
$1N25520: D7.2(A) Q5.3(C) RELAY5.4
$1N25525: LED9.1(C) Q5.1(B)
$1N25527: LED9.2(A) R12.2
$1N25856: LED10.1(C) Q6.1(B)
$1N26187: LED11.1(C) Q7.1(B)
$1N30433: D11.1(A) DC1.4
$1N73185: RELAY2.2 U21.1
$1N73235: RELAY3.2 U23.1
$1N73285: RELAY4.2 U25.1
$1N73335: RELAY5.2 U27.1
Net-(D12-2): D12.2(A) Q6.3(C) RELAY6.4
Net-(D13-2): D13.2(A) Q7.3(C) RELAY7.4
Net-(LED10-2): LED10.2(A) R19.2
Net-(LED11-2): LED11.2(A) R20.2
Net-(RELAY6-2): RELAY6.2 U31.1
Net-(RELAY7-2): RELAY7.2 U33.1

Not connected (* = marked no-connect by the designer): RELAY1 2 3*; RELAY2 3* 5; RELAY3 3* 5; RELAY4 3* 5; RELAY5 3* 5; RELAY6 3* 5; RELAY7 3* 5; U1 9(CTS#)* 10(DSR#)* 11(RI#)* 12(DCD#)* 13(DTR#)* 14(RTS#)* 15(R232)*; U6 10(PA0/ADC_IN0/VREF+/CMP1_P/OPA1_P)* 11(PA1/ADC_IN1/CMP1_N/OPA1_N)* 14(PA4/SPI0_CS/UART1_TX/UART0_TX)* 15(PA5/SPI0_SCK/UART1_RX/UART0_RX/ADC_IN5/CMP0_P3/OPA0_OUT)* 16(PA6/SPI0_MISO/TIM1_BKIN/TIM6/CH1/ADC_IN6)* 17(PA7/SPI0_MOSI/TIM1_CJ1N/ADC_ETR/TIM7_CH1/ADC_IN7)* 18(PB0/TIM1_CH2N/ADC_IN12)* 20(PF2/TIM5_CH1)* 21(PB10/SPI1_SCK/I2C0_SCL/I2C1_SCL/TIM6_CH1/CMP_P1)* 22(PB11/I2C0_SDA/I2C1_SDA/TIM7_CH1/CMP0_P2)* 25(PB12/SPI0_CS/TIM1_BKIN/SPI1_CS)* 26(PB13/SPI0_SCK/TIM1_CH1N/SPI1_SCK/I2C1_SDA)* 27(PB14/SPI0_MISO/TIM1_CH2N/SPI1_MISO/TIM5_CH1)* 28(PB15/SPI0_MOSI/TIM1_CH3N/SPI1_MOSI/TIM5_CH1N)* 31(PA10/CMP1_OUT/TIM1_CH3/UART1_RX/I2C1_SDA/TIM7_BKIN)* 32(PA11/I2C1_SCL/TIM1_CH4/I2C0_SCL)* 33(PA12/I2C1_SDA/TIM1_CH4N/I2C0_SDA/TIM1_ETR)* 38(PA15/SPI1_CS/UART1_RX/UART0_RX/CMP0_P0)* 46(PB9/IR_TXD/I2C0_SDA/TIM7_CH1/CMP2_P2)*; U22 1; U24 1; U26 1; U28 1; U30 2(Vout)*; U32 1; U34 1

## Notes on the sheets
sheet 1
- CH340
- CTRL_MCU
- 限流电阻
- DC_IN
- LDO
- DEBUG
- Crystal
- USB
- LED

# Board PCB1
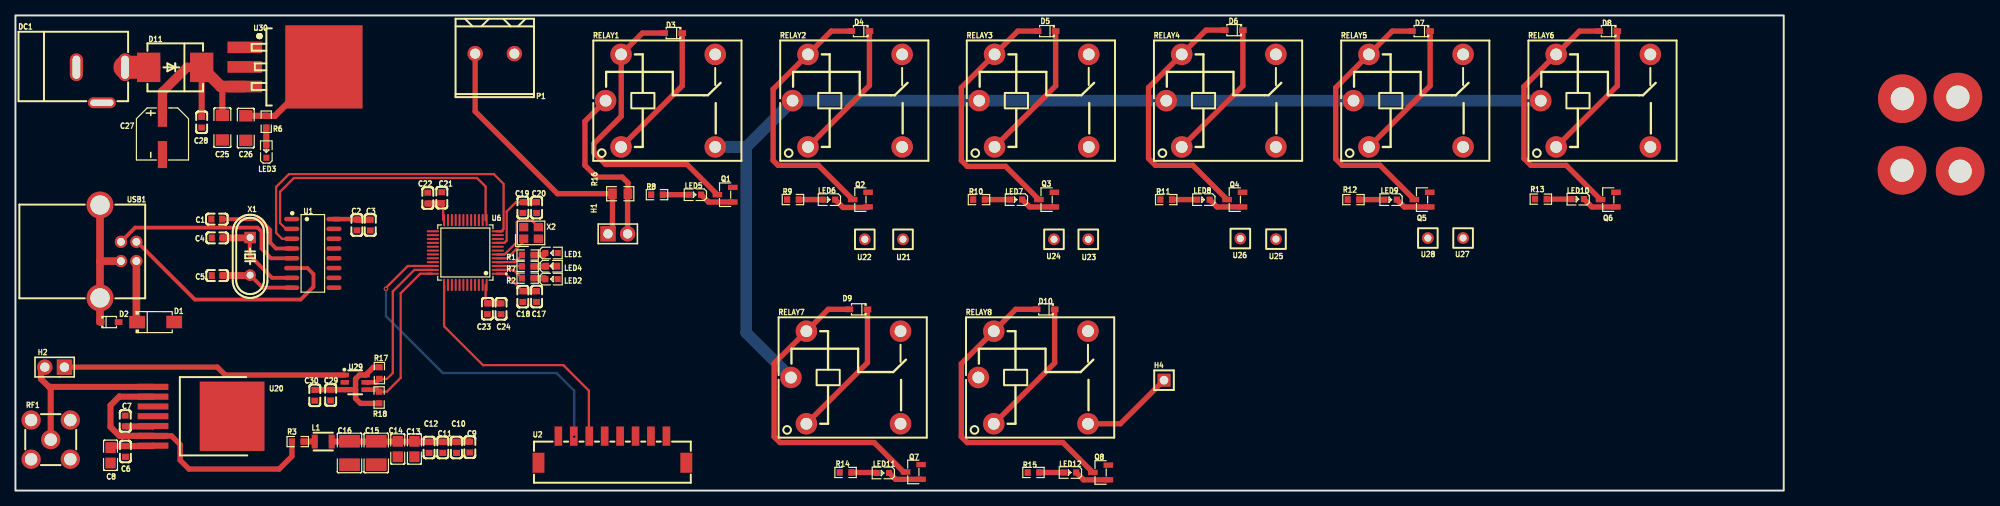
[diagram p2: board, top side]
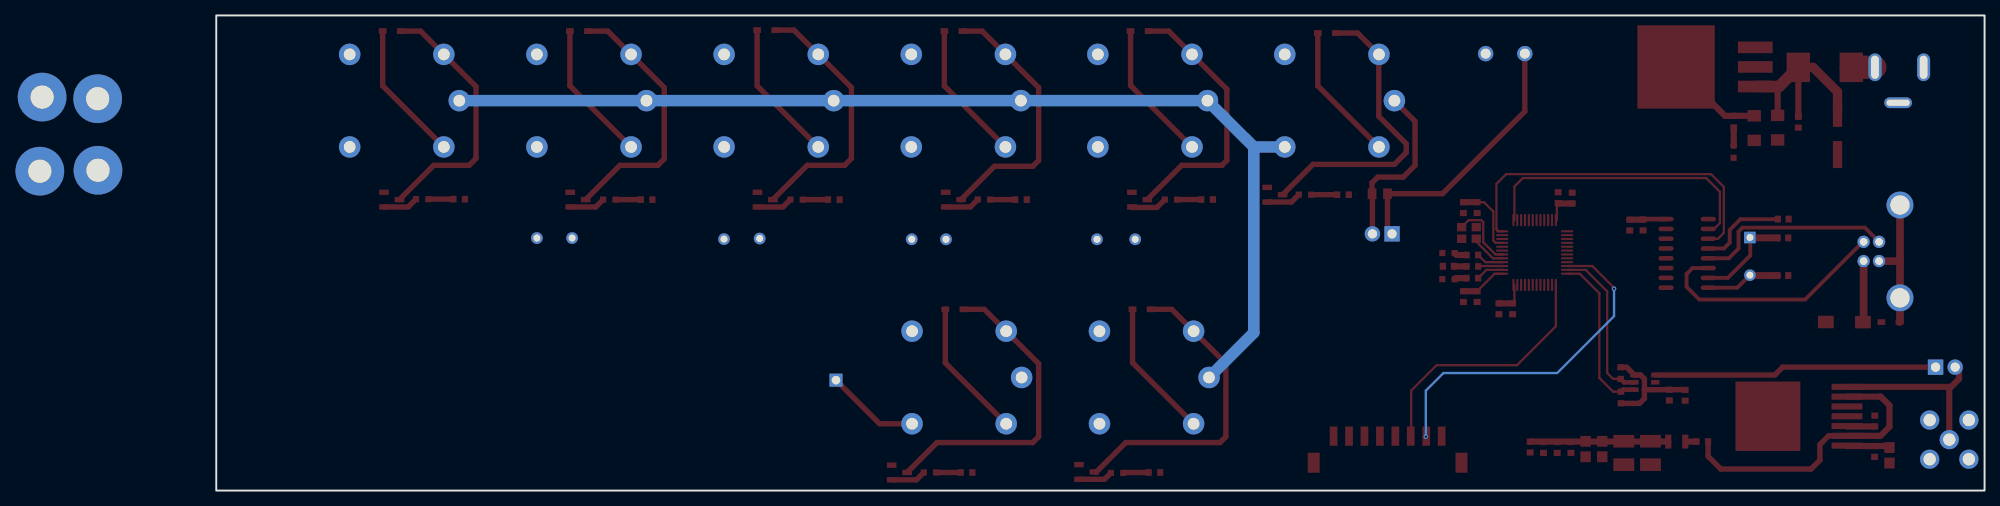
[diagram p3: board, bottom side, seen from below]

Outline 229.11 x 61.59 mm; copper layers: Top Layer, Bottom Layer. Coordinates in mm from the lower left corner of the outline.
Outline path: rectangle 0,61.59 229.11,0
Stack: Top Layer 0.035mm / Dielectric1 1.51mm FR4 er 4.5 / Bottom Layer 0.035mm

## Design rules (mm)
template: JLCPCB Capability(Two Layers Board)
spacing copperThickness1oz (default): track to track 0.102, other pairs 0.152 to 0.3
spacing copperThickness2oz: track to track 0.203, other pairs 0.152 to 0.3
track width copperThickness1oz (default): min 0.127, default 0.254, max 2.54
track width copperThickness2oz: min 0.203, default 0.254, max 2.54
differential pair differentialPair (default): width min 0.127, default 0.254, max 2.54; gap min 0.152, default 0.152
via viaSize (default): diameter min 0.5, default 0.61, max 10; hole min 0.3, default 0.305, max 6.3

## Placement (name value [footprint] x y rotation side)
C1  100nF  [C0603]  26.08 35.19 180 top
C2  100nF  [C0603]  44.25 34.43 90 top
C3  10uF  [C0603]  45.97 34.42 270 top
C4  22pF  [C0603]  26.14 32.76 0 top
C5  22pF  [C0603]  26.14 27.87 0 top
C6  100nF  [C0603]  14.25 5.08 90 top
C7  100nF  [C0603]  14.22 9.02 270 top
C8  10uF  [C0805]  12.32 4.57 90 top
C9  100nF  [C0603]  58.87 5.64 90 top
C10  100nF  [C0603]  57.15 5.59 90 top
C11  10uF  [C0603]  55.37 5.59 90 top
C12  10uF  [C0603]  53.59 5.59 90 top
C13  100uF  [C0805]  51.69 5.38 90 top
C14  100uF  [C0805]  49.53 5.38 90 top
C15  47uF  [C1210]  46.75 4.88 270 top
C16  47uF  [C1210]  43.28 4.88 270 top
C17  10uF  [C0603]  67.52 25.15 270 top
C18  100nF  [C0603]  65.74 25.15 90 top
C19  100nF  [C0603]  65.75 36.68 270 top
C20  10uF  [C0603]  67.53 36.68 90 top
C21  100nF  [C0603]  55.25 37.97 90 top
C22  10uF  [C0603]  53.42 37.91 270 top
C23  100nF  [C0603]  61.15 23.56 270 top
C24  10uF  [C0603]  62.92 23.56 90 top
C25  10uF  [C1206]  26.81 47.04 270 top
C26  10uF  [C1206]  29.84 46.99 90 top
C27  100uF  [CAP-SMD_BD6.3-L6.6-W6.6-LS7.6-FD-1]  19.05 46.23 270 top
C28  100nF  [C0603]  24.13 47.75 90 top
C29  100nF  [C0603]  40.84 12.38 270 top
C30  10uF  [C0603]  38.79 12.35 90 top
D1  SMAJ5.0A  [SMA_L4.3-W2.6-LS5.0-RD]  18.16 21.84 0 top
D2  1N5819WS  [SOD-323_L1.8-W1.3-LS2.5-RD]  12.19 21.84 0 top
D3  1N4148WS  [SOD-323_L1.8-W1.3-LS2.5-RD]  85.22 59.31 180 top
D4  1N4148WS  [SOD-323_L1.8-W1.3-LS2.5-RD]  109.47 59.56 180 top
D5  1N4148WS  [SOD-323_L1.8-W1.3-LS2.5-RD]  133.6 59.56 180 top
D6  1N4148WS  [SOD-323_L1.8-W1.3-LS2.5-RD]  157.86 59.69 180 top
D7  1N4148WS  [SOD-323_L1.8-W1.3-LS2.5-RD]  182.12 59.56 180 top
D8  1N4148WS  [SOD-323_L1.8-W1.3-LS2.5-RD]  206.38 59.56 180 top
D9  1N4148WS  [SOD-323_L1.8-W1.3-LS2.5-RD]  109.22 23.49 180 top
D10  1N4148WS  [SOD-323_L1.8-W1.3-LS2.5-RD]  133.48 23.49 180 top
D11  SS36-E3/57T  [SMC_L7.1-W6.2-LS8.1-R-RD]  20.7 54.86 180 top
DC1  HX DC005 QT  [DC-IN-TH_HANXIA_HX-DC005-QT]  11.05 52.58 0 top
H1  PZ254V-11-02P  [HDR-TH_2P-P2.54-V-M]  78.04 33.28 0 top
H2  PZ254V-11-02P  [HDR-TH_2P-P2.54-V-M]  5.08 16 180 top
H4  PZ254V-11-01P  [HDR-TH_1P-P2.54-V-M]  148.81 14.31 0 top
J2  -  [DEMO板安装孔]  244.43 41.52 0 top
J3  -  [DEMO板安装孔]  244.48 50.8 0 top
J4  -  [DEMO板安装孔]  251.67 51.01 0 top
J5  -  [DEMO板安装孔]  251.97 41.4 0 top
L1  10uH  [IND-SMD_L2.5-W1.8]  39.88 6.35 0 top
LED1  NCD0603R1  [LED0603-RD_RED]  69.45 30.79 0 top
LED2  19-217/GHC-YR1S2/3T  [LED0603-RD]  69.45 27.41 0 top
LED3  19-217/GHC-YR1S2/3T  [LED0603-RD]  32.51 43.94 90 top
LED4  19-217/BHC-ZL1M2RY/3T  [LED0603-FD_BLUE]  69.47 29.08 0 top
LED5  19-217/GHC-YR1S2/3T  [LED0603-RD]  88.05 38.36 180 top
LED6  19-217/GHC-YR1S2/3T  [LED0603-RD]  105.41 37.72 180 top
LED7  19-217/GHC-YR1S2/3T  [LED0603-RD]  129.64 37.73 180 top
LED8  19-217/GHC-YR1S2/3T  [LED0603-RD]  153.92 37.72 180 top
LED9  19-217/GHC-YR1S2/3T  [LED0603-RD]  178.18 37.72 180 top
LED10  19-217/GHC-YR1S2/3T  [LED0603-RD]  202.43 37.78 180 top
LED11  19-217/GHC-YR1S2/3T  [LED0603-RD]  112.39 2.29 180 top
LED12  19-217/GHC-YR1S2/3T  [LED0603-RD]  136.64 2.35 180 top
P1  WJ500V-5.08-2P  [CONN-TH_2P-P5.00_WJ500V-5.08-2P]  62.1 56.64 180 top
Q1  SS8050  [SOT-23-3_L2.9-W1.3-P1.90-LS2.4-BR]  91.95 38.35 0 top
Q2  SS8050  [SOT-23-3_L2.9-W1.3-P1.90-LS2.4-BR]  109.47 37.72 0 top
Q3  SS8050  [SOT-23-3_L2.9-W1.3-P1.90-LS2.4-BR]  133.6 37.72 0 top
Q4  SS8050  [SOT-23-3_L2.9-W1.3-P1.90-LS2.4-BR]  157.99 37.72 0 top
Q5  SS8050  [SOT-23-3_L2.9-W1.3-P1.90-LS2.4-BR]  182.25 37.72 0 top
Q6  SS8050  [SOT-23-3_L2.9-W1.3-P1.90-LS2.4-BR]  206.38 37.72 0 top
Q7  SS8050  [SOT-23-3_L2.9-W1.3-P1.90-LS2.4-BR]  116.33 2.41 0 top
Q8  SS8050  [SOT-23-3_L2.9-W1.3-P1.90-LS2.4-BR]  140.6 2.35 0 top
R1  10K  [R0603]  66.37 30.54 0 top
R2  10K  [R0603]  66.37 27.53 0 top
R3  10mΩ  [R0603]  36.58 6.35 0 top
R6  10kΩ  [R0603]  32.5 47.82 90 top
R7  10K  [R0603]  66.37 29.06 0 top
R8  10K  [R0603]  83.12 38.36 0 top
R9  10K  [R0603]  100.74 37.73 0 top
R10  10K  [R0603]  124.84 37.72 0 top
R11  10K  [R0603]  149.1 37.72 0 top
R12  10K  [R0603]  173.36 37.72 0 top
R13  10K  [R0603]  197.64 37.78 0 top
R14  10K  [R0603]  107.55 2.35 0 top
R15  10K  [R0603]  131.9 2.35 0 top
R16  100Ω  [R0805]  78.36 38.48 0 top
R17  4.7kΩ  [R0603]  47.15 15.23 90 top
R18  4.7kΩ  [R0603]  47.12 12.06 270 top
RELAY1  SRD-12VDC-SL-C  [RELAY-TH_SRD-XXVDC-XL-C]  83.57 50.55 0 top
RELAY2  SRD-12VDC-SL-C  [RELAY-TH_SRD-XXVDC-XL-C]  107.78 50.55 0 top
RELAY3  SRD-12VDC-SL-C  [RELAY-TH_SRD-XXVDC-XL-C]  131.96 50.55 0 top
RELAY4  SRD-12VDC-SL-C  [RELAY-TH_SRD-XXVDC-XL-C]  156.21 50.55 0 top
RELAY5  SRD-12VDC-SL-C  [RELAY-TH_SRD-XXVDC-XL-C]  180.47 50.55 0 top
RELAY6  SRD-12VDC-SL-C  [RELAY-TH_SRD-XXVDC-XL-C]  204.72 50.55 0 top
RELAY7  SRD-12VDC-SL-C  [RELAY-TH_SRD-XXVDC-XL-C]  107.58 14.66 0 top
RELAY8  SRD-12VDC-SL-C  [RELAY-TH_SRD-XXVDC-XL-C]  131.86 14.66 0 top
RF1  KH-SMA-KE-Z  [SMA-TH_KH-SMA-KE-Z]  4.57 6.6 0 top
U1  CH340G  [SOIC-16_L9.9-W3.9-P1.27-LS6.0-BL]  38.53 30.75 270 top
U2  A2008WV-S-8P  [CONN-SMD_A2008WV-S-8P]  77.34 5.33 0 top
U6  PT32A030C8T7  [LQFP-48_7.0X7.0X0.5P]  58.29 30.86 90 top
U20  OPA548F/500  [TO-263-7_L10.2-W10.4-P1.27-LS14.4-TL]  22.95 9.63 0 top
U21  X5511FV-01-C30D97-0970  [HDR-TH_1P-V-F-1]  115 32.58 90 top
U22  X5511FV-01-C30D97-0970  [HDR-TH_1P-V-F-1]  110.05 32.58 90 top
U23  X5511FV-01-C30D97-0970  [HDR-TH_1P-V-F-1]  139 32.58 180 top
U24  X5511FV-01-C30D97-0970  [HDR-TH_1P-V-F-1]  134.56 32.58 180 top
U25  X5511FV-01-C30D97-0970  [HDR-TH_1P-V-F-1]  163.32 32.6 180 top
U26  X5511FV-01-C30D97-0970  [HDR-TH_1P-V-F-1]  158.7 32.67 180 top
U27  X5511FV-01-C30D97-0970  [HDR-TH_1P-V-F-1]  187.56 32.74 0 top
U28  X5511FV-01-C30D97-0970  [HDR-TH_1P-V-F-1]  183 32.74 0 top
U29  MCP4716A0T-E/CH  [SOT-23-6_L2.9-W1.6-P0.95-LS2.8-BR]  44.01 14.03 180 top
U30  AMS1086CM-5.0  [TO-263-3_L8.6-W10.2-P2.54-LS14.4-TL]  34.84 54.92 0 top
USB1  USB-B10-BRW  [USB-B-TH_USB-B10-BRW]  13.31 31 270 top
X1  12MHz  [HC-49US_L11.5-W4.5-P4.88]  30.4 30.37 270 top
X2  25MHz  [OSC-SMD_4P-L2.5-W2.0-BL]  66.8 33.4 0 top

## Footprints (pads in the part's own frame, mm; a bottom-side part is the same pattern mirrored in y, then rotated)
C0603
  rect 0.8x0.9 smd: 1(-0.7,0) 2(0.7,0)
C0805
  rect 1.41x1.35 smd: 1(-1,0) 2(1,0)
C1206
  rect 1.485x1.728 smd: 1(-1.593,0) 2(1.593,0)
C1210
  rect 1.635x2.7 smd: 1(-1.518,0) 2(1.518,0)
CAP-SMD_BD6.3-L6.6-W6.6-LS7.6-FD-1
  rect 3.5x1.2 smd: 1(-2.67,0) 2(2.67,0)
CONN-SMD_A2008WV-S-8P
  rect 1x2.5 smd: 1(-7,1.724) 2(-5,1.724) 3(-3,1.724) 4(-1,1.724) 5(1,1.724) 6(2.999,1.724) 7(5,1.724) 8(7,1.724)
  rect 1.55x2.6 smd: 9(-9.575,-1.724) 10(9.575,-1.724)
CONN-TH_2P-P5.00_WJ500V-5.08-2P
  round 2 hole 1.3: 1(-2.54,0) 2(2.54,0)
DC-IN-TH_HANXIA_HX-DC005-QT
  oval 3.6x1.4 hole 3x0.8: 2(0.15,-2.3)
  oval 1.7x3.6 hole 1x3: 3(-3.15,2.3) 4(3.15,2.3)
DEMO板安装孔
  round 6.32 hole 3: 1(0,0)
HC-49US_L11.5-W4.5-P4.88
  rect 1.5x1.5 hole 0.9: 1(-2.44,0)
  round 1.5 hole 0.9: 2(2.44,0)
HDR-TH_1P-P2.54-V-M
  rect 1.7x1.7 hole 1.1: 1(0,0)
HDR-TH_1P-V-F-1
  round 1.524 hole 0.914: 1(0,0)
HDR-TH_2P-P2.54-V-M
  rect 2x2 hole 1.2: 1(-1.27,0)
  round 2 hole 1.2: 2(1.27,0)
IND-SMD_L2.5-W1.8
  rect 0.8x1.8 smd: 1(-1.1,0) 2(1.1,0)
LED0603-FD_BLUE
  rect 0.8x0.9 smd: 1(-0.72,0) 2(0.72,0)
LED0603-RD
  rect 0.8x0.8 smd: 1(-0.799,-0.004) 2(0.799,0.004)
LED0603-RD_RED
  rect 0.8x0.8 smd: 1(-0.799,-0.004) 2(0.799,0.004)
LQFP-48_7.0X7.0X0.5P
  oval 0.28x1.6 smd: 1(-2.75,-4.2) 2(-2.25,-4.2) 3(-1.75,-4.2) 4(-1.25,-4.2) 5(-0.75,-4.2) 6(-0.25,-4.2) 7(0.25,-4.2) 8(0.75,-4.2) 9(1.25,-4.2) 10(1.75,-4.2) 11(2.25,-4.2) 12(2.75,-4.2) 25(2.75,4.2) 26(2.25,4.2) 27(1.75,4.2) 28(1.25,4.2) 29(0.75,4.2) 30(0.25,4.2) 31(-0.25,4.2) 32(-0.75,4.2) 33(-1.25,4.2) 34(-1.75,4.2) 35(-2.25,4.2) 36(-2.75,4.2)
  oval 1.6x0.28 smd: 13(4.2,-2.75) 14(4.2,-2.25) 15(4.2,-1.75) 16(4.2,-1.25) 17(4.2,-0.75) 18(4.2,-0.25) 19(4.2,0.25) 20(4.2,0.75) 21(4.2,1.25) 22(4.2,1.75) 23(4.2,2.25) 24(4.2,2.75) 37(-4.2,2.75) 38(-4.2,2.25) 39(-4.2,1.75) 40(-4.2,1.25) 41(-4.2,0.75) 42(-4.2,0.25) 43(-4.2,-0.25) 44(-4.2,-0.75) 45(-4.2,-1.25) 46(-4.2,-1.75) 47(-4.2,-2.25) 48(-4.2,-2.75)
OSC-SMD_4P-L2.5-W2.0-BL
  rect 1.2x1.1 smd: 1(-0.95,-0.75) 2(0.95,-0.75) 3(0.95,0.75) 4(-0.95,0.75)
R0603
  rect 0.806x0.864 smd: 1(-0.753,0) 2(0.753,0)
R0805
  rect 1.133x1.377 smd: 1(-1,0) 2(1,0)
RELAY-TH_SRD-XXVDC-XL-C
  round 2.794 hole 1.524: 1(-5.1,-6) 2(7.1,-6) 3(7.1,6) 4(-5.1,6) 5(-7.1,0)
SMA-TH_KH-SMA-KE-Z
  round 2.5 hole 1.6: 1(-2.54,-2.54) 2(-2.54,2.54) 3(2.54,2.54) 4(2.54,-2.54) 5(-0.001,0.001)
SMA_L4.3-W2.6-LS5.0-RD
  rect 2.046x1.62 smd: 1(-2.404,-0.009) 2(2.404,0.009)
SMC_L7.1-W6.2-LS8.1-R-RD
  rect 3.03x3.82 smd: 1(3.435,0) 2(-3.435,0)
SOD-323_L1.8-W1.3-LS2.5-RD
  rect 1x0.75 smd: 1(-1.173,0) 2(1.173,0)
SOIC-16_L9.9-W3.9-P1.27-LS6.0-BL
  oval 0.602x1.971 smd: 1(-4.445,-2.736) 2(-3.175,-2.736) 3(-1.905,-2.736) 4(-0.635,-2.736) 5(0.635,-2.736) 6(1.905,-2.736) 7(3.175,-2.736) 8(4.445,-2.736) 9(4.445,2.736) 10(3.175,2.736) 11(1.905,2.736) 12(0.635,2.736) 13(-0.635,2.736) 14(-1.905,2.736) 15(-3.175,2.736) 16(-4.445,2.736)
SOT-23-3_L2.9-W1.3-P1.90-LS2.4-BR
  rect 1.25x0.7 smd: 1(1,-0.95) 2(1,0.95) 3(-1,0)
SOT-23-6_L2.9-W1.6-P0.95-LS2.8-BR
  rect 1.1x0.6 smd: 1(1.35,-0.95) 2(1.35,0) 3(1.35,0.95) 4(-1.35,0.95) 5(-1.35,0) 6(-1.35,-0.95)
TO-263-3_L8.6-W10.2-P2.54-LS14.4-TL
  rect 4.5x1.511 smd: 1(-5.128,2.54) 2(-5.128,0) 3(-5.128,-2.54)
  rect 10.02x10.8 smd: 4(5.129,0)
TO-263-7_L10.2-W10.4-P1.27-LS14.4-TL
  rect 4x0.8 smd: 1(-5.122,3.81) 2(-5.122,2.54) 3(-5.122,1.27) 4(-5.122,0) 5(-5.122,-1.27) 6(-5.122,-2.54) 7(-5.122,-3.81)
  rect 8.4x9 smd: 8(5.122,0)
USB-B-TH_USB-B10-BRW
  round 1.6 hole 1: 1(1.25,2.355) 2(-1.25,2.355) 3(-1.25,0.355) 4(1.25,0.355)
  round 3.5 hole 2.5: 5(-6.02,-2.355) 6(6.02,-2.355)

## Nets
GND: C1.2 C2.1 C3.2 C4.1 C5.1 C6.1 C7.1 C8.1 C9.1 C10.1 C11.1 C12.1 C13.1 C14.1 C15.2 C16.2 C17.2 C18.1 C19.2 C20.1 C21.2 C22.1 C23.2 C24.1 C25.2 C26.1 C27.2 C28.1 C29.2 C30.1 D1.2 D2.2 DC1.2 DC1.3 J2.1 J3.1 J4.1 J5.1 LED3.1 P1.1 Q1.2 Q2.2 Q3.2 Q4.2 Q5.2 Q6.2 Q7.2 Q8.2 RELAY6.2 RF1.1 RF1.2 RF1.3 RF1.4 U1.1 U2.8 U2.9 U2.10 U6.8 U6.23 U6.47 U20.3 U20.4 U20.8 U22.1 U24.1 U26.1 U28.1 U29.2 U30.1 X2.2 X2.4
DAC_OUT: H2.1 U29.1
DC_5V: H1.1 P1.2 R16.1
DC_12V: C6.2 C7.2 C8.2 C25.1 C27.1 C28.2 D3.1 D4.1 D5.1 D6.1 D7.1 D8.1 D9.1 D10.1 D11.2 RELAY1.1 RELAY2.1 RELAY3.1 RELAY4.1 RELAY5.1 RELAY6.1 RELAY7.1 RELAY8.1 U20.5 U20.7 U30.3
DUT_SEND_SIGNAL: H4.1 RELAY8.2
DUT_VCC: C9.2 C10.2 C11.2 C12.2 C13.2 C14.2 C15.1 C16.1 L1.2 RELAY7.2
I2C_SCL: R17.1 U6.35 U29.5
I2C_SDA: R18.1 U6.36 U29.4
LDO_5V: C2.2 C3.1 C17.1 C18.2 C19.1 C20.2 C21.1 C22.2 C23.1 C24.2 C26.2 C29.1 C30.2 D1.1 LED1.2 LED2.2 LED4.2 R6.2 R17.2 R18.2 U1.16 U2.1 U6.1 U6.9 U6.24 U6.48 U29.3 U29.6 U30.4 USB1.1
LED_BLUE: R7.1 U6.3
LED_GREEN: R2.1 U6.2
LED_RED: R1.1 U6.4
MCO: U2.7 U6.30
MCU_GET_SIGNAL: RELAY8.5 U6.29
OSC_IN: U6.5 X2.1
OSC_OUT: U6.6 X2.3
RF_OUT: H2.2 RF1.5 U20.1
RLY1_CTRL: R8.1 U6.19
RLY1_IN: H1.2 R16.2 RELAY1.5
RLY2_CTRL: R9.1 U6.44
RLY3_CTRL: R10.1 U6.39
RLY4_CTRL: R11.1 U6.40
RLY5_CTRL: R12.1 U6.41
RLY6_CTRL: R13.1 U6.42
RLY7_CTRL: R14.1 U6.43
RLY8_CTRL: R15.1 U6.45
RSTN: U2.6 U6.7
SWCLK: U2.3 U6.37
SWDIO: U2.2 U6.34
UART_RX: U1.2 U2.5 U6.13
UART_TX: U1.3 U2.4 U6.12
USB_D+: U1.5 USB1.3
USB_D-: U1.6 USB1.2
$1N609: C1.1 U1.4
$1N927: C4.2 U1.7 X1.1
$1N934: C5.2 U1.8 X1.2
$1N1592: D2.1 USB1.4 USB1.5 USB1.6
$1N3043: LED2.1 R2.2
$1N3044: LED1.1 R1.2
$1N17434: R3.1 U20.2 U20.6
$1N17437: L1.1 R3.2
$1N19109: LED3.2 R6.1
$1N19270: LED4.1 R7.2
$1N21850: D3.2 Q1.3 RELAY1.4
$1N23236: LED5.1 Q1.1
$1N23238: LED5.2 R8.2
$1N23497: D4.2 Q2.3 RELAY2.4
$1N23502: LED6.1 Q2.1
$1N23504: LED6.2 R9.2
$1N24457: D5.2 Q3.3 RELAY3.4
$1N24462: LED7.1 Q3.1
$1N24464: LED7.2 R10.2
$1N24850: D6.2 Q4.3 RELAY4.4
$1N24855: LED8.1 Q4.1
$1N24857: LED8.2 R11.2
$1N25520: D7.2 Q5.3 RELAY5.4
$1N25525: LED9.1 Q5.1
$1N25527: LED9.2 R12.2
$1N25851: D8.2 Q6.3 RELAY6.4
$1N25856: LED10.1 Q6.1
$1N25858: LED10.2 R13.2
$1N26182: D9.2 Q7.3 RELAY7.4
$1N26187: LED11.1 Q7.1
$1N26189: LED11.2 R14.2
$1N26508: D10.2 Q8.3 RELAY8.4
$1N26513: LED12.1 Q8.1
$1N26515: LED12.2 R15.2
$1N30433: D11.1 DC1.4
$1N72979: RELAY1.2 RELAY2.5 RELAY3.5 RELAY4.5 RELAY5.5 RELAY6.5 RELAY7.5
$1N73185: RELAY2.2 U21.1
$1N73235: RELAY3.2 U23.1
$1N73285: RELAY4.2 U25.1
$1N73335: RELAY5.2 U27.1

Pads without a net: RELAY1 3; RELAY2 3; RELAY3 3; RELAY4 3; RELAY5 3; RELAY6 3; RELAY7 3; RELAY8 3; U1 9 10 11 12 13 14 15; U6 10 11 14 15 16 17 18 20 21 22 25 26 27 28 31 32 33 38 46; U30 2

## Via types
v1: diameter 0.61, hole 0.305, Top Layer to Bottom Layer, 2 vias

## Routing (per net, layer and track width the routed paths; a pad name or vN(x,y) marks a point on that pad's centre or on a via; arc(x,y) is an arc through that point)
DAC_OUT: length 36.7
  Top Layer w0.7: U29.1 27.18,14.98 26.16,16 H2.1
DC_5V: length 35.2
  Top Layer w0.7: P1.2 59.56,49.15 70.23,38.48 R16.1 77.36,33.87 H1.1
DC_12V: length 180.9
  Top Layer w0.7: D9.1 110.39,16.58 RELAY7.1 ; D3.1 86.39,52.47 RELAY1.1 ; D4.1 110.65,52.51 RELAY2.1 ; RELAY8.1 134.65,16.55 D10.1 ; D7.1 183.29,52.47 RELAY5.1 ; D8.1 207.55,52.47 RELAY6.1 ; RELAY3.1 134.78,52.46 D5.1 ; RELAY4.1 159.03,52.47 D6.1
  Top Layer w0.8: C28.2 24.13,54.86 D11.2 ; C25.1 26.81,52.19 ; U20.7 17.78,5.78 C6.2 12.52,5.78 C8.2 ; U20.5 17.78,8.32 C7.2
  Top Layer w1.2: D11.2 22.22,54.86 19.05,51.69 C27.1
  Top Layer w1.5: D11.2 26.62,52.38 U30.3
DUT_SEND_SIGNAL: length 12.2
  Top Layer w0.7: H4.1 143.17,8.66 138.96,8.66
DUT_VCC: length 17.9
  Top Layer w0.8: L1.2 58.86,6.35 C9.2
I2C_SCL: length 20.8
  Top Layer w0.3: R17.1 48.13,14.48 48.89,15.24 48.89,25.82 51.69,28.61 53.97,28.61
  Top Layer w0.6: U29.5 46.71,14.03 R17.1
I2C_SDA: length 21.5
  Top Layer w0.3: 53.97,28.11 52.44,28.11 49.91,25.58 49.91,14.6 48.13,12.83 47.13,12.83 R18.1
  Top Layer w0.6: R18.1 46.86,13.08 U29.4
LDO_5V: length 64.3
  Top Layer w0.3: C23.1 60.92,24.5 60.92,26.66 ; 62.37,28.11 63.48,28.11 C18.2 ; C21.1 55.42,37.1 55.42,35.06 ; 62.37,32.11 63.35,32.11 63.65,32.41 63.65,36.17 64.86,37.38 C19.1
  Top Layer w0.6: U1.16 44.18,35.19
  Top Layer w0.7: 44.07,13.06 44.07,14.48 44.58,14.99 45.36,14.99 U29.6 46.37,15.98 R17.2 ; 44.07,13.06 44.07,11.94 44.7,11.3 47.11,11.3 R18.2 ; 44.07,13.06 44.05,13.08 U29.3 40.84,13.08 ; C30.2 38.81,13.08 C29.1
  Top Layer w0.8: C2.2 44.26,35.12 C3.1 ; C17.1 C18.2 ; C22.2 55.19,37.21 C21.1 ; C19.1 C20.2 ; C23.1 C24.2 ; C26.2 32.49,48.58 32.5,48.57 33.62,48.57 U30.4
  Top Layer w1: D1.1 15.67,21.92 15.67,29.75
LED_BLUE: length 3.3
  Top Layer w0.3: 62.37,29.11 65.56,29.11 R7.1
LED_GREEN: length 3.7
  Top Layer w0.3: R2.1 64.54,28.61 62.37,28.61
LED_RED: length 3.6
  Top Layer w0.3: R1.1 64.68,29.61 62.37,29.61
OSC_IN: length 4.8
  Top Layer w0.3: X2.1 65.85,32.27 63.69,30.11 62.37,30.11
OSC_OUT: length 9.1
  Top Layer w0.3: 62.37,30.61 63.37,30.61 64.95,32.19 64.95,34.8 65.2,35.05 66.85,35.05 X2.3
RF_OUT: length 23.2
  Top Layer w0.8: 4.46,13.44 4.57,13.34 RF1.5 ; 4.46,13.44 4.34,13.44 3.3,14.48 3.3,15.88 ; 4.46,13.44 U20.1
RLY1_IN: length 22.6
  Top Layer w0.7: H1.2 79.31,38.43 R16.2 79.36,39.89 78.61,40.64 75.31,40.64 73.79,42.16 73.79,47.87 RELAY1.5
SWCLK: length 33.4
  Top Layer w0.3: U2.3 74.3,7.11 74.3,12.95 70.99,16.26 60.58,16.26 55.54,21.29 55.54,26.53
SWDIO: length 45.4
  Top Layer w0.3: U2.2 72.39,7.01 v1(72.39,6.98) ; v1(48.01,26.16) 48.01,26.29 50.83,29.11 U6.34
  Bottom Layer w0.3: v1(48.01,26.16) 48.01,22.61 55.37,15.24 70.1,15.24 72.39,12.95 v1(72.39,6.98)
UART_RX: length 38.1
  Top Layer w0.3: 60.92,35.06 60.92,39.41 59.82,40.51 36.07,40.51 34.29,38.73 34.29,34.67 35.05,33.91 35.78,33.91 U1.2
UART_TX: length 45.8
  Top Layer w0.3: 62.37,33.61 62.95,33.61 63.25,33.91 63.25,39.75 61.98,41.02 35.43,41.02 33.78,39.37 33.78,33.4 34.54,32.64 35.78,32.64 U1.3
USB_D+: length 25.8
  Top Layer w0.5: 13.67,32.25 15.51,34.09 31.38,34.09 31.88,33.59 31.88,31.37 33.13,30.11 U1.5
USB_D-: length 31.5
  Top Layer w0.5: U1.6 37.83,28.84 38.61,28.07 38.61,26.42 36.96,24.77 23.24,24.77 15.76,32.25 15.67,32.25
$1N609: length 11.6
  Top Layer w0.5: U1.4 33.77,31.38 33.02,32.13 33.02,33.78 31.62,35.18 26.8,35.18 C1.1
$1N927: length 12.5
  Top Layer w0.5: U1.7 33.26,27.57 30.35,30.48 30.35,32.76 X1.1
  Top Layer w0.9: C4.2 30.35,32.76
$1N934: length 9.7
  Top Layer w0.5: X1.2 32.03,26.3 U1.8
  Top Layer w0.9: C5.2 30.35,27.87 X1.2
$1N1592: length 17.9
  Top Layer w1: 13.67,29.75 11.02,29.75 10.96,29.69 ; 10.96,29.69 USB1.6 10.96,21.9 D2.1 ; 10.96,29.69 USB1.5
$1N3043: length 1.6
  Top Layer w0.8: R2.2 68.52,27.53 LED2.1
$1N3044: length 1.6
  Top Layer w0.8: R1.2 68.4,30.54 LED1.1
$1N17434: length 38.3
  Top Layer w0.7: R3.1 35.82,4.44 34.17,2.79 22.48,2.79 21.34,3.94 21.34,5.97 20.21,7.09 U20.6
  Top Layer w0.8: U20.2 13.48,12.17 13.46,12.19 12.32,11.05 12.32,8.25 13.48,7.09 U20.6
$1N17437: length 1.4
  Top Layer w0.8: R3.2 L1.1
$1N19109: length 2.3
  Top Layer w0.8: LED3.2 32.5,44.75 R6.1
$1N19270: length 1.6
  Top Layer w0.8: R7.2 68.73,29.06 LED4.1
$1N21850: length 39.2
  Top Layer w0.7: Q1.3 87.01,42.29 76.45,42.29 74.93,43.81 74.93,44.96 78.49,48.51 78.49,56.53 RELAY1.4 81.23,59.31 D3.2
$1N23236: length 4.5
  Top Layer w0.7: Q1.1 89.81,37.4 LED5.1
$1N23238: length 3.4
  Top Layer w0.7: R8.2 83.88,38.36 LED5.2
$1N23497: length 34.9
  Top Layer w0.7: Q2.3 104.03,42.16 98.81,42.16 98.17,42.8 98.17,52.04 RELAY2.4 105.7,59.56 D4.2
$1N23502: length 4.7
  Top Layer w0.7: LED6.1 107.23,36.7 110.41,36.7 Q2.1
$1N23504: length 3.1
  Top Layer w0.7: LED6.2 104.6,37.73 R9.2
$1N24457: length 34.5
  Top Layer w0.7: D5.2 129.88,59.56 RELAY3.4 122.55,52.24 122.55,42.8 123.32,42.04 128.29,42.04 Q3.3
$1N24462: length 4.6
  Top Layer w0.7: LED7.1 131.4,36.77 Q3.1
$1N24464: length 3.3
  Top Layer w0.7: LED7.2 128.84,37.72 R10.2
$1N24850: length 34.5
  Top Layer w0.7: Q4.3 152.54,42.16 147.7,42.16 146.81,43.05 146.81,52.25 RELAY4.4 154.25,59.69 D6.2
$1N24855: length 4.7
  Top Layer w0.7: LED8.1 155.68,36.77 Q4.1
$1N24857: length 3.3
  Top Layer w0.7: LED8.2 153.12,37.72 R11.2
$1N25520: length 34.5
  Top Layer w0.7: D7.2 178.38,59.56 RELAY5.4 171.07,52.25 171.07,42.99 171.9,42.16 176.8,42.16 Q5.3
$1N25525: length 4.7
  Top Layer w0.7: Q5.1 179.93,36.77 LED9.1
$1N25527: length 3.3
  Top Layer w0.7: LED9.2 174.11,37.72 R12.2
$1N25851: length 34.2
  Top Layer w0.7: D8.2 202.64,59.56 RELAY6.4 195.45,52.38 195.45,43.05 196.34,42.16 200.93,42.16 Q6.3
$1N25856: length 4.6
  Top Layer w0.7: Q6.1 204.24,36.77 LED10.1
$1N25858: length 3.2
  Top Layer w0.7: LED10.2 198.39,37.78 R13.2
$1N26182: length 41.1
  Top Layer w0.7: Q7.3 115.08,2.41 111.27,6.22 99.06,6.22 98.3,6.98 98.3,16.48 RELAY7.4 105.31,23.49 D9.2
$1N26187: length 4.5
  Top Layer w0.7: LED11.1 114.02,1.46 Q7.1
$1N26189: length 3.3
  Top Layer w0.7: R14.2 111.53,2.35 LED11.2
$1N26508: length 41.1
  Top Layer w0.7: D10.2 129.6,23.49 RELAY8.4 122.55,16.45 122.55,6.98 123.32,6.22 135.72,6.22 Q8.3
$1N26513: length 4.6
  Top Layer w0.7: LED12.1 138.39,1.4 141.6,1.4
$1N26515: length 3.2
  Top Layer w0.7: LED12.2 132.66,2.34 R15.2
$1N30433: length 3.1
  Top Layer w3: D11.1 17.25,54.88 DC1.4
$1N72979: length 141.7
  Bottom Layer w1.5: 94.68,44.55 RELAY1.2 ; 94.68,44.55 RELAY2.5 RELAY3.5 197.62,50.55 RELAY6.5 ; 94.68,44.55 94.68,20.46 RELAY7.5
